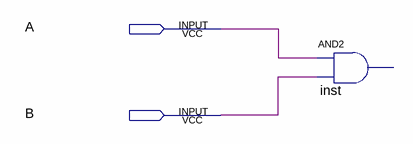
[diagram p0: schematic sheet]
// Quartus schematic lab1step1.bdf as structural Verilog: 1 symbols, 2 pins
module lab1step1 (
  input  A,
  input  B
);

  // AND2 inst has open pins: IN1=A, IN2=B, OUT=open
endmodule
